# Altium schematic sheet FCU_v1.0.SchDoc
size A; SheetNumber: 1; SheetTotal: 1
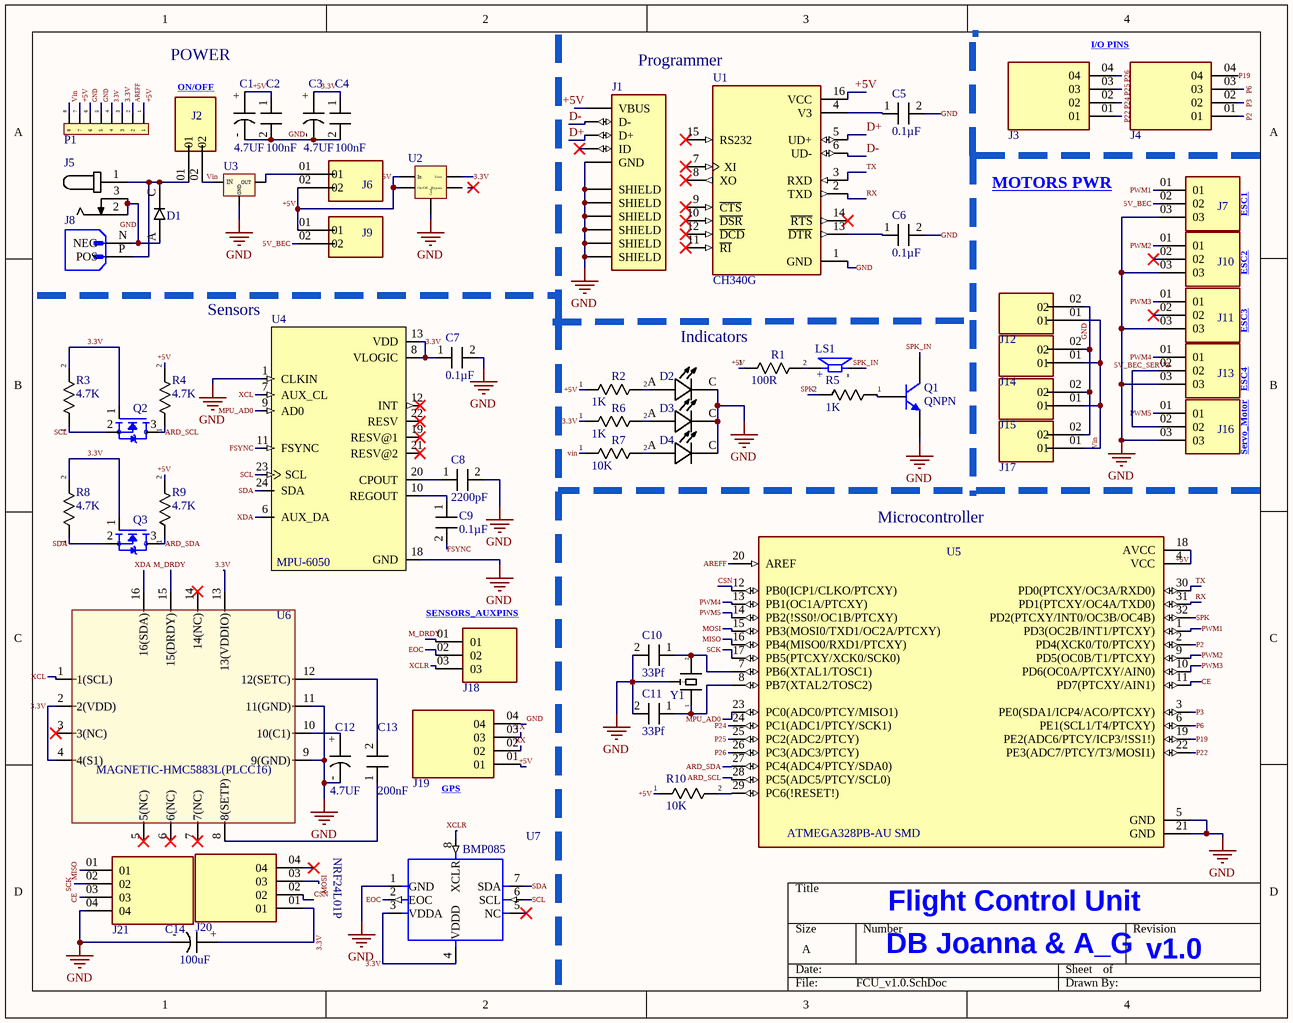
[diagram p0: FCU_v1.0.SchDoc]

## Parts
C1  4.7UF  [10SVP4R7M]
C2  100nF  [CC0805JKX7R7BB105]
C3  4.7UF  [10SVP4R7M]
C4  100nF  [CC0805JKX7R7BB105]
C5  0.1µF  [CC0805JKX7R7BB105]
C6  0.1µF  [CC0805JKX7R7BB105]
C7  0.1µF  [CC0805JKX7R7BB105]
C8  2200pF  [CC0805JKX7R7BB105]
C9  0.1µF  [CC0805JKX7R7BB105]
C10  33Pf  [CC0805JKX7R7BB105]
C11  33Pf  [CC0805JKX7R7BB105]
C12  4.7UF  [10SVP4R7M]
C13  200nF  [CC0805JKX7R7BB105]
C14  100uF  [10SVP4R7M]
D1  CD1206-S01575  [CD1206-S01575]  (value not drawn)
D2  LEDC2012X70N  [LEDC2012X70N]  (value not drawn)
D3  LEDC2012X70N  [LEDC2012X70N]  (value not drawn)
D4  LEDC2012X70N  [LEDC2012X70N]  (value not drawn)
J1  USB_MICRO_USB3076-XX-X_REVC5  [USB_MICRO_GCT_USB3076-XX-X_REVC5]  (value not drawn)
J2  PINHEADER_2_61300211121  [PINHEADER_2_WURTH_61300211121]  (value not drawn)
J3  PinHeader_4_TS-104-T-AA  [PinHeader_4_SAMTEC_TS-104-T-AA]  (value not drawn)
J4  PinHeader_4_TS-104-T-AA  [PinHeader_4_SAMTEC_TS-104-T-AA]  (value not drawn)
J5  PJ-002AH  [PJ-002AH]  (value not drawn)
J6  PINHEADER_2_61300211121  [PINHEADER_2_WURTH_61300211121]  (value not drawn)
J7  PinHead_M_TSW-103-07-G-S  [PinHeader_M_SAMTEC_TSW-103-07-G-S]  (value not drawn)
J8  LIPO_CONN_XT90PW-M  [LIPO_CONN_AMASS_XT90PW-M]  (value not drawn)
J9  PINHEADER_2_61300211121  [PINHEADER_2_WURTH_61300211121]  (value not drawn)
J10  PinHead_M_TSW-103-07-G-S  [PinHeader_M_SAMTEC_TSW-103-07-G-S]  (value not drawn)
J11  PinHead_M_TSW-103-07-G-S  [PinHeader_M_SAMTEC_TSW-103-07-G-S]  (value not drawn)
J12  PINHEADER_2_61300211121  [PINHEADER_2_WURTH_61300211121]  (value not drawn)
J13  PinHead_M_TSW-103-07-G-S  [PinHeader_M_SAMTEC_TSW-103-07-G-S]  (value not drawn)
J14  PINHEADER_2_61300211121  [PINHEADER_2_WURTH_61300211121]  (value not drawn)
J15  PINHEADER_2_61300211121  [PINHEADER_2_WURTH_61300211121]  (value not drawn)
J16  PinHead_M_TSW-103-07-G-S  [PinHeader_M_SAMTEC_TSW-103-07-G-S]  (value not drawn)
J17  PINHEADER_2_61300211121  [PINHEADER_2_WURTH_61300211121]  (value not drawn)
J18  PinHead_M_TSW-103-07-G-S  [PinHeader_M_SAMTEC_TSW-103-07-G-S]  (value not drawn)
J19  PinHeader_4_TS-104-T-AA  [PinHeader_4_SAMTEC_TS-104-T-AA]  (value not drawn)
J20  PinHeader_4_TS-104-T-AA  [PinHeader_4_SAMTEC_TS-104-T-AA]  (value not drawn)
J21  PinHeader_4_TS-104-T-AA  [PinHeader_4_SAMTEC_TS-104-T-AA]  (value not drawn)
LS1  speaker CST-951AP  [speaker CUI_CST-951AP]  (value not drawn)
P1  PWR Connectors  [PPTC081LFBN-RC]  (value not drawn)
Q1  QNPN  [SOT-23B_N]
Q2  mosfet_BSS138  [mosfet_SOT95P240X111-3N]  (value not drawn)
Q3  mosfet_BSS138  [mosfet_SOT95P240X111-3N]  (value not drawn)
R1  100R  [RMCF0805FT8K06]
R2  1K  [RMCF0805FT8K06]
R3  4.7K  [RMCF0805FT8K06]
R4  4.7K  [RMCF0805FT8K06]
R5  1K  [RMCF0805FT8K06]
R6  1K  [RMCF0805FT8K06]
R7  10K  [RMCF0805FT8K06]
R8  4.7K  [RMCF0805FT8K06]
R9  4.7K  [RMCF0805FT8K06]
R10  10K  [RMCF0805FT8K06]
U1  CH340G  [CH340G_SOIC127P600X180-16N]
U2  LP2985-33DBVR  [LP2985-33DBVR]  (value not drawn)
U3  SPX1117M3-L-5-0/TR  [SPX1117M3-L-5-0/TR]  (value not drawn)
U4  MPU-6050  [MPU-6050]
U5  ATMEGA328PB-AU SMD  [ATMEGA328PB-AU SMD]
U6  MAGNETIC-HMC5883L(PLCC16)  [MAGNETIC-HMC5883L(PLCC16)]
U7  SENSOR-PRESSURE-BMP085(PLCC8)  [BMP085_LCC8-1.27-5.0X5.0MM]  (value not drawn)
Y1  CSTCE16M0V53-R0  [CSTCE16M0V53-R0]  (value not drawn)

## Nets
GND: C1.- C2.2 C3.- C4.2 C5.2 C6.2 C7.2 C8.2 C10.2 C11.2 C12.- C14.- D1.A D2.C D3.C D4.C J1.5(GND) J1.6(SHIELD) J1.7(SHIELD) J1.8(SHIELD) J1.9(SHIELD) J1.10(SHIELD) J1.11(SHIELD) J5.2 J5.3 J7.03 J8.N(NEG) J10.03 J11.03 J12.02 J13.03 J14.02 J15.02 J16.03 J17.02 J19.04 J21.04 P1.5 P1.6 Q1.3(E) U1.1(GND) U2.3(Gnd) U3.2(GND) U4.1(CLKIN) U4.18(GND) U5.5(GND) U5.21(GND) U6.9(9(GND)) U6.11(11(GND)) U7.1(GND) Y1.Gnd
3.3V: C3.+ C4.1 C7.1 C14.+ J20.01 P1.3 P1.4 Q2.1(G) Q3.1(G) R3.2 R6.1 R8.2 U2.5(Vout) U4.8(VLOGIC) U4.13(VDD) U6.2(2(VDD)) U6.4(4(S1)) U6.13(13(VDDIO)) U7.3(VDDA) U7.4(VDDD)
5V_BEC: J7.02 J9.02
5V_BEC_SERVO: J13.02 J16.02
+5V: C1.+ C2.1 J1.1(VBUS) J6.02 J9.01 J19.01 P1.1 P1.7 R1.1 R2.1 R4.2 R9.2 R10.1 U1.16(VCC) U2.1(In) U2.2(On/Off) U5.4(VCC) U5.18(AVCC)
ARD_SCL: Q2.3(D) R4.1 U5.28(PC5(ADC5/PTCY/SCL0))
ARD_SDA: Q3.3(D) R9.1 U5.27(PC4(ADC4/PTCY/SDA0))
AREFF: P1.2 U5.20(AREF)
CE: J21.03 U5.11(PD7(PTCXY/AIN1))
CSN: J20.02 U5.12(PB0(ICP1/CLKO/PTCXY))
D+: J1.3(D+) U1.5(UD+)
D-: J1.2(D-) U1.6(UD-)
EOC: J18.02 U7.2(EOC)
FSYNC: C9.2 U4.11(FSYNC)
M_DRDY: J18.01 U6.15(15(DRDY))
MISO: J21.01 U5.16(PB4(MISO0/RXD1/PTCXY))
MOSI: J20.03 U5.15(PB3(MOSI0/TXD1/OC2A/PTCXY))
MPU_AD0: U4.9(AD0) U5.23(PC0(ADC0/PTCY/MISO1))
P2: J4.01 U5.2(PD4(XCK0/T0/PTCXY))
P3: J4.02 U5.3(PE0(SDA1/ICP4/ACO/PTCXY))
P6: J4.03 U5.6(PE1(SCL1/T4/PTCXY))
P19: J4.04 U5.19(PE2(ADC6/PTCY/ICP3/!SS1!))
P22: J3.01 U5.22(PE3(ADC7/PTCY/T3/MOSI1))
P24: J3.02 U5.24(PC1(ADC1/PTCY/SCK1))
P25: J3.03 U5.25(PC2(ADC2/PTCY))
P26: J3.04 U5.26(PC3(ADC3/PTCY))
PWM1: J7.01 U5.1(PD3(OC2B/INT1/PTCXY))
PWM2: J10.01 U5.9(PD5(OC0B/T1/PTCXY))
PWM3: J11.01 U5.10(PD6(OC0A/PTCXY/AIN0))
PWM4: J13.01 U5.13(PB1(OC1A/PTCXY))
PWM5: J16.01 U5.14(PB2(!SS0!/OC1B/PTCXY))
RX: J19.02 U1.2(TXD) U5.31(PD1(PTCXY/OC4A/TXD0))
SCK: J21.02 U5.17(PB5(PTCXY/XCK0/SCK0))
SCL: Q2.2(S) R3.1 U4.23(SCL) U7.6(SCL)
SDA: Q3.2(S) R8.1 U4.24(SDA) U7.7(SDA)
SPK: R5.2 U5.32(PD2(PTCXY/INT0/OC3B/OC4B))
SPK_IN: LS1.M Q1.1(C)
TX: J19.03 U1.3(RXD) U5.30(PD0(PTCXY/OC3A/RXD0))
Vin: J2.02 J12.01 J14.01 J15.01 J17.01 P1.8 R7.1 U3.1(IN)
XCL: U4.7(AUX_CL) U6.1(1(SCL))
XCLR: J18.03 U7.8(XCLR)
XDA: U4.6(AUX_DA) U6.16(16(SDA))
NetC5_1: C5.1 U1.4(V3)
NetC6_1: C6.1 U1.13(~{DTR})
NetC8_1: C8.1 U4.20(CPOUT)
NetC9_1: C9.1 U4.10(REGOUT)
NetC10_1: C10.1 U5.7(PB6(XTAL1/TOSC1)) Y1.2
NetC11_1: C11.1 U5.8(PB7(XTAL2/TOSC2)) Y1.1
NetC12_+: C12.+ U6.10(10(C1))
NetC13_1: C13.1 U6.8(8(SETP))
NetC13_2: C13.2 U6.12(12(SETC))
NetD1_C: D1.C J2.01 J5.1 J8.P(POS)
NetD2_A: D2.A R2.2
NetD3_A: D3.A R6.2
NetD4_A: D4.A R7.2
NetJ6_01: J6.01 U3.3(OUT)
NetLS1_P: LS1.P R1.2
NetQ1_2: Q1.2(B) R5.1
NetR10_2: R10.2 U5.29(PC6(!RESET!))

Not connected (* = marked no-connect by the designer): J1 4(ID)*; J10 02*; J11 02*; J20 04*; U1 7(XI)* 8(XO)* 9(~{CTS})* 10(~{DSR})* 11(~{RI})* 12(~{DCD})* 14(~{RTS})* 15(RS232)*; U2 4(Bypass); U4 12(INT)* 19(RESV@1)* 21(RESV@2)* 22(RESV)*; U6 3(3(NC))* 5(5(NC))* 6(6(NC))* 7(7(NC))* 14(14(NC))*; U7 5(NC)*

## Notes on the sheet
- POWER
- ON/OFF
- Programmer
- (near J3) I/O PINS
- MOTORS PWR
- ESC1
- ESC2
- (near U4) Sensors
- (near R1) Indicators
- ESC3
- Servo_Motor
- ESC4
- (near U5) Microcontroller
- (near J18) SENSORS_AUXPINS
- GPS
- NRF24L01P
- (near U7) BMP085
- (near U5) Flight Control Unit
- DB Joanna & A_G
- v1.0
- (in symbol speaker CST-951AP) +; -

## Library data of the parts
C1 C3 C12 C14 = 10SVP4R7M: 4.7 µF 10 V Aluminum - Polymer Capacitors Radial, Can - SMD 240mOhm 2000 Hrs @ 105°C; Value: CAP ALUM POLY 4.7UF 20% 10V SMD; P/N: 10SVP4R7M; Digi Key Link: https://www.digikey.com/en/products/detail/panasonic-electronic-components/10SVP4R7M/4204769
C2 C4-C11 C13 = CC0805JKX7R7BB105: 1 µF ±5% 16V Ceramic Capacitor X7R 0805 (2012 Metric); P/N: CC0805JKX7R7BB105; Value: 1 µF ±5% 16V; Digi Key Link: https://www.digikey.com/en/products/detail/yageo/CC0805JKX7R7BB105/7164381
D1 = CD1206-S01575: Diode 100 V 150mA Surface Mount 1206 [D2 UNO]
D2-D4 = LEDC2012X70N: SMD LED 0805; P/N: LEDC2012X70N
J1 = USB_MICRO_USB3076-XX-X_REVC5: USB - micro B USB 2.0 Receptacle Connector 5 Position Surface Mount, Right Angle; Through Hole, 2.35mm profile, 5 Pins, Horizontal, Bottom mount; MP: USB3076-30-A; MF: Global Connector Technology; SnapEDA_Link: https://www.snapeda.com/parts/USB3076-30-A/Global+Connector+Technology/view-part/?ref=snap; Package: None; Check_prices: https://www.snapeda.com/parts/USB3076-30-A/Global+Connector+Technology/view-part/?ref=eda; Purchase-URL: https://pricing.snapeda.com/search/part/USB3076-30-A/?ref=eda; Price: None; Value: *; Availability: In Stock
J2 J6 J9 J12 J14 J15 J17 = PINHEADER_2_61300211121: Connector Header Through Hole 2 position 0.100 (2.54mm); MF: Wurth Elektronik; SnapEDA_Link: https://www.snapeda.com/parts/61300211121/Wurth+Elektronik/view-part/?ref=snap; Package: None; Value: *; MP: 61300211121; Check_prices: https://www.snapeda.com/parts/61300211121/Wurth+Elektronik/view-part/?ref=eda
J3 J4 J19-J21 = PinHeader_4_TS-104-T-AA: TS - Samtec 2.54mm Single Row Machined Terminal Strip - Fast Stock; Check_prices: https://www.snapeda.com/parts/TS-104-T-AA/Samtec/view-part/3454870/?ref=eda; MF: Samtec; Value: *; SnapEDA_Link: https://www.snapeda.com/parts/TS-104-T-AA/Samtec/view-part/3454870/?ref=snap; Availability: In Stock; Package: None; Purchase-URL: https://pricing.snapeda.com/search/part/TS-104-T-AA/?ref=eda; Price: None; MP: TS-104-T-AA
J5 = PJ-002AH: 2.0 x 6.5 mm, 5.0 A, Horizontal, Through Hole, Dc Power Jack Connector; P/N: PJ-002AH
J7 J10 J11 J13 J16 J18 = PinHead_M_TSW-103-07-G-S: <a href="https://pricing.snapeda.com/parts/TSW-103-07-G-S/Samtec/view-part?ref=eda">Check availability</a>; MP: altium_native_batch; Package: None; Price: None; Value: *; Availability: Unavailable
J8 = LIPO_CONN_XT90PW-M: Socket; DC supply; XT90; male; PIN: 2; on PCBs; THT; Colour: yellow; MF: AMASS; SnapEDA_Link: https://www.snapeda.com/parts/XT90PW-M/AMASS/view-part/?ref=snap; Package: Package; Value: *; MP: XT90PW-M; Check_prices: https://www.snapeda.com/parts/XT90PW-M/AMASS/view-part/?ref=eda
LS1 = speaker CST-951AP: 9 mm, 5 V, 85 dB, Through Hole, Magnetic Audio Transducer Buzzer; Availability: Unavailable; Price: None; Value: *; MP: CST-951AP; Package: None
P1 = PPTC081LFBN-RC: 8 Position Header Connector 0.100" (2.54mm) Through Hole Tin
Q1 = QNPN: NPN Bipolar Transistor; Published: 8-Jun-2000; LatestRevisionDate: 29-May-2009; LatestRevisionNote: IPC-7351 Footprint Added.; PackageVersion: Aug-1999; PackageReference: SOT-23B; Publisher: Altium Limited; PackageDescription: 3-Pin SOT-23 Package 0.95 mm Pitch, 2.4 mm Lead Span
Q2 Q3 = mosfet_BSS138: N-Channel 50 V 220mA (Ta) 350mW (Ta) Surface Mount SOT-23-3; MF: onsemi; MP: BSS138; SnapEDA_Link: https://www.snapeda.com/parts/BSS138/Onsemi/view-part/?ref=snap; Package: SOT-23-3 Motorola; Value: *; Check_prices: https://www.snapeda.com/parts/BSS138/Onsemi/view-part/?ref=eda
R1-R10 = RMCF0805FT8K06: 8.06 kOhms ±1% 0.125W, 1/8W Chip Resistor 0805 (2012 Metric) Automotive AEC-Q200 Thick Film; Value: 8.06K; P/N: RMCF0805FT8K06
U1 = CH340G: USB Interface Integrated Circuit; MF: WCH; Value: *; SnapEDA_Link: https://www.snapeda.com/parts/Ch340G/WCH/view-part/?ref=snap; MP: Ch340G; Check_prices: https://www.snapeda.com/parts/Ch340G/WCH/view-part/?ref=eda; Availability: Not in stock; Price: None; Package: None
U2 = LP2985-33DBVR: Linear Voltage Regulator IC 3.3 V Positive Fixed 1 Output 150mA SOT-23-5
U3 = SPX1117M3-L-5-0/TR: Linear Voltage Regulator IC Positive Fixed 1 Output 800mA SOT-223-3
U4 = MPU-6050: MPU-6050 series Accelerometer, Gyroscope, 3 Axis Sensor Evaluation Board
U5 = ATMEGA328PB-AU SMD: AVR AVRÂ® ATmega Microcontroller IC 8-Bit 20MHz 32KB _16K x 16_ FLASH 32-TQFP _7x7_
U6 = MAGNETIC-HMC5883L(PLCC16): HMC5883L HMC Magnetic, Digital Compass Sensor Evaluation Board
U7 = SENSOR-PRESSURE-BMP085(PLCC8): Pressure Sensor 4.35PSI ~ 15.95PSI (30kPa ~ 110kPa) Absolute 16 ~ 19 b 8-CLCC; MF: Bosch; MP: BMP085; Check_prices: https://www.snapeda.com/parts/BMP085/Bosch%20Sensortec/view-part/44086/?ref=eda; Value: *; Price: None; Availability: Bad; Package: CLCC-8 Bosch; SnapEDA_Link: https://www.snapeda.com/parts/BMP085/Bosch%20Sensortec/view-part/44086/?ref=snap
Y1 = CSTCE16M0V53-R0: 16 MHz Ceramic Resonator Built in Capacitor 15 pF ±0.3% -20°C ~ 80°C Surface Mount